# Altium schematic sheet breakbeam-interface.SchDoc
size A4
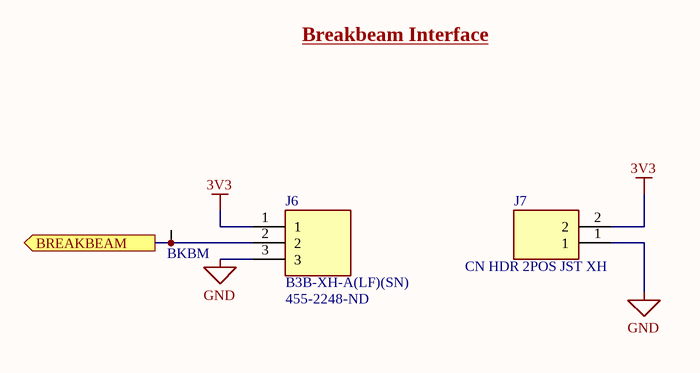
[diagram p0: breakbeam-interface.SchDoc]

## Parts
BKBM  Test Point (Via)  [TP]  (value not drawn)
J6  B3B-XH-A(LF)(SN)  Supplier Part Number 1: 455-2248-ND  [JST_B3B-XH-A(LF)(SN)]
J7  CN HDR 2POS JST XH  [JST_B2B-XH-A(LF)(SN)]

## Ports
BREAKBEAM (out)

## Nets
3V3: J6.1 J7.2
GND: J6.3 J7.1
BREAKBEAM: BKBM.1 J6.2 ; port BREAKBEAM

## Notes on the sheet
- Breakbeam Interface

## Library data of the parts
J6 = CN HDR 3POS JST XH: Connector Header Through Hole 3 position 0.098 (2.50mm); MF: JST Sales; Check_prices: https://www.snapeda.com/parts/B3B-XH-A(LF)(SN)/JST%20Sales%20America%20Inc./view-part/231271/?ref=eda; Value: *; Package: None; Price: None; Availability: In Stock; MP: B3B-XH-A(LF)(SN); SnapEDA_Link: https://www.snapeda.com/parts/B3B-XH-A(LF)(SN)/JST%20Sales%20America%20Inc./view-part/231271/?ref=snap; Supplier 1: Digi-Key
J7 = CN HDR 2POS JST XH: Connector Header Through Hole 2 position 0.098 _2.50mm_ / JST XH; MP: B2B-XH-A_LF__SN_; MF: JST Sales; Price: None; Package: None; Value: *; Availability: Unavailable; SnapEDA_Link: https://www.snapeda.com/parts/B2B-XH-A%28LF%29%28SN%29/JST%20Sales%20America%20Inc./view-part/492310/?ref=snap; Supplier 1: Digi-Key; Supplier Part Number 1: 455-2247-ND; Supplier 2: RSComponents; Supplier Part Number 2: 1667312; Supplier 3: RSComponents; Supplier Part Number 3: 8201554